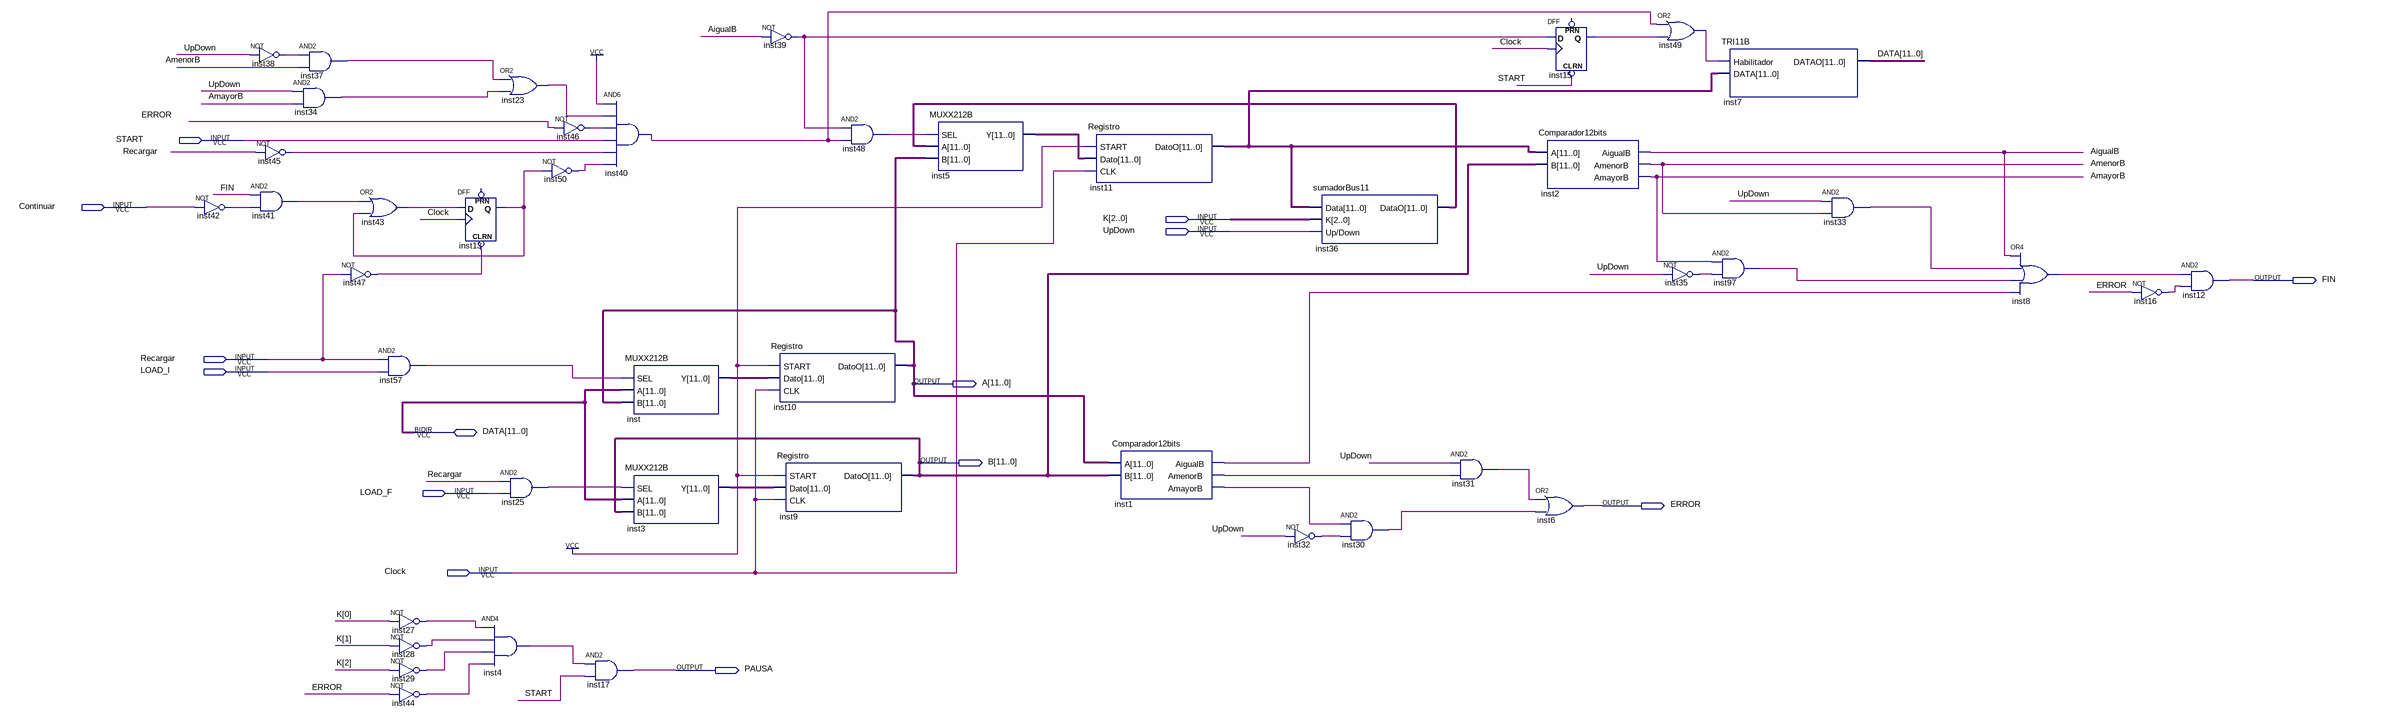
[diagram p0: schematic sheet]
// Quartus schematic Integrador.bdf as structural Verilog: 45 symbols, 14 pins
module Integrador (
  input  START,
  input  Continuar,
  input  [2:0] K,
  input  UpDown,
  input  Recargar,
  input  LOAD_I,
  input  LOAD_F,
  input  Clock,
  inout  [11:0] DATA,
  output FIN,
  output [11:0] A,
  output [11:0] B,
  output ERROR,
  output PAUSA
);

  wire AigualB, AmayorB, AmenorB, inst1_aigualb, inst1_amayorb, inst1_amenorb, inst4_out, inst8_out,
       inst13_q, inst15_q, inst16_out, inst23_out, inst25_out, inst27_out, inst28_out, inst29_out,
       inst30_out, inst31_out, inst32_out, inst33_out, inst34_out, inst35_out, inst37_out, inst38_out,
       inst39_out, inst40_out, inst41_out, inst42_out, inst43_out, inst44_out, inst45_out, inst46_out,
       inst47_out, inst48_out, inst49_out, inst50_out, inst57_out, inst97_out;
  wire [11:0] inst3_y, inst5_y, inst11_datoo, inst36_datao, inst_y;

  not inst42 (inst42_out, Continuar);
  not inst38 (inst38_out, UpDown);
  not inst45 (inst45_out, Recargar);
  and inst41 (inst41_out, FIN, inst42_out);
  and inst37 (inst37_out, inst38_out, AmenorB);
  and inst34 (inst34_out, UpDown, AmayorB);
  or inst43 (inst43_out, inst41_out, inst13_q);
  not inst47 (inst47_out, Recargar);
  and inst57 (inst57_out, Recargar, LOAD_I);
  not inst27 (inst27_out, K[0]);
  not inst28 (inst28_out, K[1]);
  not inst29 (inst29_out, K[2]);
  not inst44 (inst44_out, ERROR);
  DFF inst13 (.CLRN(inst47_out), .CLK(Clock), .D(inst43_out), .Q(inst13_q));  // open: PRN
  or inst23 (inst23_out, inst37_out, inst34_out);
  and inst25 (inst25_out, Recargar, LOAD_F);
  and inst4 (inst4_out, inst27_out, inst28_out, inst29_out, inst44_out);
  not inst46 (inst46_out, ERROR);
  not inst50 (inst50_out, inst13_q);
  and inst40 (inst40_out, 1'b1, inst23_out, inst46_out, START, inst45_out, inst50_out);
  MUXX212B inst (.SEL(inst57_out), .A(DATA), .B(A), .Y(inst_y));
  MUXX212B inst3 (.SEL(inst25_out), .A(DATA), .B(B), .Y(inst3_y));
  and inst17 (PAUSA, inst4_out, START);
  not inst39 (inst39_out, AigualB);
  Registro inst10 (.START(1'b1), .Dato(inst_y), .CLK(Clock), .DatoO(A));
  Registro inst9 (.START(1'b1), .Dato(inst3_y), .CLK(Clock), .DatoO(B));
  and inst48 (inst48_out, inst39_out, inst40_out);
  MUXX212B inst5 (.SEL(inst48_out), .A(inst36_datao), .B(A), .Y(inst5_y));
  Registro inst11 (.START(1'b1), .Dato(inst5_y), .CLK(Clock), .DatoO(inst11_datoo));
  Comparador12bits inst1 (.A(A), .B(B), .AigualB(inst1_aigualb), .AmenorB(inst1_amenorb), .AmayorB(inst1_amayorb));
  not inst32 (inst32_out, UpDown);
  sumadorBus11 inst36 (.Data(inst11_datoo), .K(K), .\Up/Down (UpDown), .DataO(inst36_datao));
  and inst30 (inst30_out, inst1_amayorb, inst32_out);
  and inst31 (inst31_out, UpDown, inst1_amenorb);
  DFF inst15 (.CLRN(START), .CLK(Clock), .D(inst39_out), .Q(inst15_q));  // open: PRN
  Comparador12bits inst2 (.A(inst11_datoo), .B(B), .AigualB(AigualB), .AmenorB(AmenorB), .AmayorB(AmayorB));
  or inst6 (ERROR, inst31_out, inst30_out);
  or inst49 (inst49_out, inst40_out, inst15_q);
  not inst35 (inst35_out, UpDown);
  TRI11B inst7 (.Habilitador(inst49_out), .DATA(inst11_datoo), .DATAO(DATA));
  and inst97 (inst97_out, AmayorB, inst35_out);
  and inst33 (inst33_out, UpDown, AmenorB);
  or inst8 (inst8_out, AigualB, inst33_out, inst97_out, inst1_aigualb);
  not inst16 (inst16_out, ERROR);
  and inst12 (FIN, inst8_out, inst16_out);
endmodule
